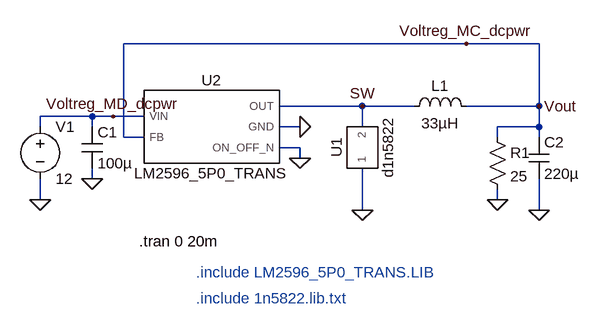
[diagram p0: schematic Two-axis robotic arm pcb simulation.asc]
Two-axis robotic arm pcb simulation.asc, the LTspice schematic file:
Version 4.1
SHEET 1 980 680
WIRE 800 112 272 112
WIRE 912 112 800 112
WIRE 640 208 512 208
WIRE 720 208 640 208
WIRE 912 208 912 112
WIRE 912 208 800 208
WIRE 224 224 144 224
WIRE 256 224 224 224
WIRE 304 224 256 224
WIRE 144 240 144 224
WIRE 224 240 224 224
WIRE 544 240 512 240
WIRE 640 240 640 208
WIRE 912 240 912 208
WIRE 912 240 848 240
WIRE 272 256 272 112
WIRE 304 256 272 256
WIRE 848 256 848 240
WIRE 912 256 912 240
WIRE 544 272 512 272
WIRE 544 288 544 272
WIRE 224 320 224 304
WIRE 144 352 144 320
WIRE 848 352 848 336
WIRE 640 368 640 304
WIRE 912 368 912 320
FLAG 144 352 0
FLAG 544 240 0
FLAG 544 288 0
FLAG 224 320 0
FLAG 912 208 Vout
FLAG 640 368 0
FLAG 848 352 0
FLAG 912 368 0
FLAG 640 208 SW
FLAG 800 112 Voltreg_MC_dcpwr
FLAG 256 224 Voltreg_MD_dcpwr
SYMBOL Voltage 144 224 R0
SYMATTR InstName V1
SYMATTR Value 12
SYMBOL Cap 208 240 R0
SYMATTR InstName C1
SYMATTR Value 100µ
SYMBOL Ind 704 224 R270
WINDOW 0 32 56 VTop 2
WINDOW 3 5 56 VBottom 2
SYMATTR InstName L1
SYMATTR Value 33µH
SYMBOL Cap 896 256 R0
SYMATTR InstName C2
SYMATTR Value 220µ
SYMBOL Res 832 240 R0
SYMATTR InstName R1
SYMATTR Value 25
SYMBOL LM2596_5P0_TRANS 400 240 R0
SYMATTR InstName U2
SYMBOL d1n5822 640 272 R270
SYMATTR InstName U1
TEXT 384 464 Left 2 ;.include LM2596_5P0_TRANS.LIB
TEXT 296 416 Left 2 !.tran 0 20m
TEXT 384 504 Left 2 ;.include 1n5822.lib.txt

The netlist it stands for:
* Two-axis robotic arm pcb simulation.asc
V1 Voltreg_MD_dcpwr 0 12
C1 Voltreg_MD_dcpwr 0 100µ
L1 SW Voltreg_MC_dcpwr 33µH
C2 Voltreg_MC_dcpwr 0 220µ
R1 Voltreg_MC_dcpwr 0 25
X§U2 Voltreg_MD_dcpwr Voltreg_MC_dcpwr SW 0 0 LM2596_5P0_TRANS  ; pins VIN FB OUT GND ON_OFF_N
X§U1 0 SW d1n5822  ; pins 1 2
* .include LM2596_5P0_TRANS.LIB
.tran 0 20m
* .include 1n5822.lib.txt
.lib C:\Users\hestia\Desktop\JD2\sim\LM2596_5P0_TRANS.LIB
.lib C:\Users\hestia\Desktop\JD2\sim\1n5822.lib.txt
.backanno
.end